# Altium project PCB_CTMB.PrjPCB
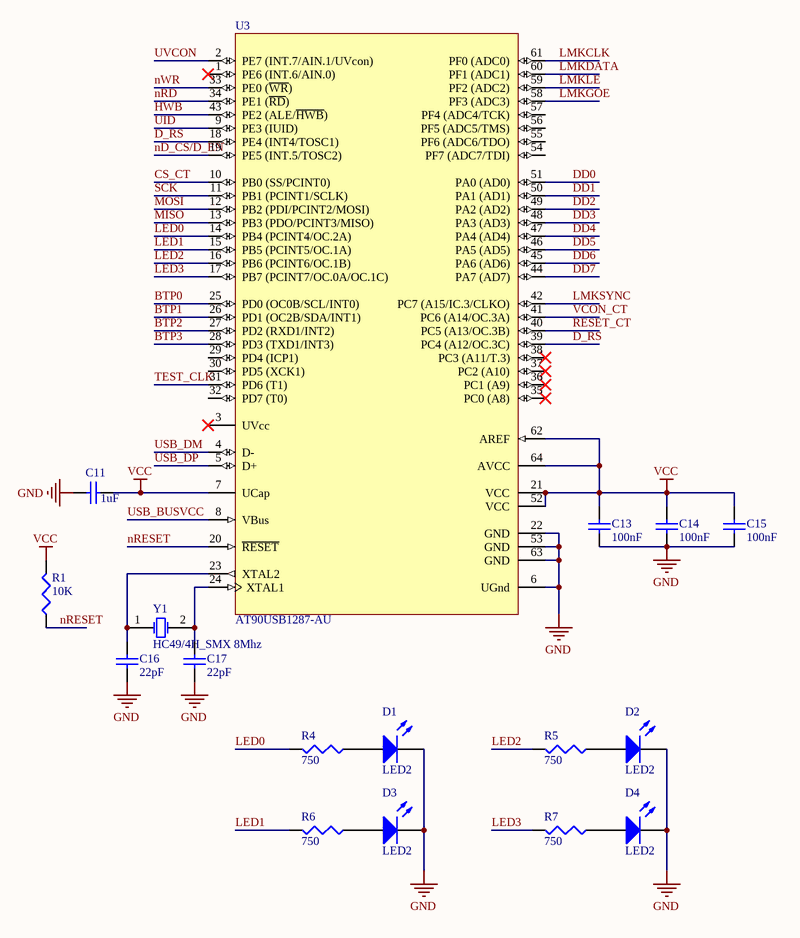
[diagram p0: ClockTamerMotherboard.SchDoc]
4 sheets, 85 parts. Net scope: global (net labels, ports and power ports of the same name join across sheets).
Board files: Board_routed.PcbDoc, Board.PcbDoc
Sheets:
  ClockTamerMotherboard.SchDoc
  Power.SchDoc
  ClockDiv.SchDoc
  Connectors.SchDoc

## Sheet ClockTamerMotherboard.SchDoc
size A4

### Parts
C11  1uF  [1608[0603]]
C13  100nF  [1608[0603]]
C14  100nF  [1608[0603]]
C15  100nF  [1608[0603]]
C16  22pF  [1608[0603]]
C17  22pF  [1608[0603]]
D1  LED2  [3.2X1.6X1.1]
D2  LED2  [3.2X1.6X1.1]
D3  LED2  [3.2X1.6X1.1]
D4  LED2  [3.2X1.6X1.1]
R1  10K  [J1-0603]
R4  750  [J1-0603]
R5  750  [J1-0603]
R6  750  [J1-0603]
R7  750  [J1-0603]
U3  AT90USB1287-AU  [64MD_N]
Y1  HC49/4H_SMX 8Mhz  [HC49/4H_SMX]

### Nets
GND: C11.1 C13.2 C14.1 C15.1 C16.1 C17.1 D1.2(K) D2.2(K) D3.2(K) D4.2(K) U3.6(UGnd) U3.22(GND) U3.53(GND) U3.63(GND)
VCC: C11.2 C13.1 C14.2 C15.2 R1.2 U3.7(UCap) U3.21(VCC) U3.52(VCC) U3.62(AREF) U3.64(AVCC)
BTP0: U3.25(PD0_(OC0B/SCL/INT0))
BTP1: U3.26(PD1_(OC2B/SDA/INT1))
BTP2: U3.27(PD2_(RXD1/INT2))
BTP3: U3.28(PD3_(TXD1/INT3))
CS_CT: U3.10(PB0_(SS/PCINT0))
D_RS: U3.18(PE4_(INT4/TOSC1)) U3.39(PC4_(A12/OC.3C))
DD0: U3.51(PA0_(AD0))
DD1: U3.50(PA1_(AD1))
DD2: U3.49(PA2_(AD2))
DD3: U3.48(PA3_(AD3))
DD4: U3.47(PA4_(AD4))
DD5: U3.46(PA5_(AD5))
DD6: U3.45(PA6_(AD6))
DD7: U3.44(PA7_(AD7))
HWB: U3.43(PE2_(ALE/~{HWB}))
LED0: R4.2 U3.14(PB4_(PCINT4/OC.2A))
LED1: R6.2 U3.15(PB5_(PCINT5/OC.1A))
LED2: R5.2 U3.16(PB6_(PCINT6/OC.1B))
LED3: R7.2 U3.17(PB7_(PCINT7/OC.0A/OC.1C))
LMKCLK: U3.61(PF0_(ADC0))
LMKDATA: U3.60(PF1_(ADC1))
LMKGOE: U3.58(PF3_(ADC3))
LMKLE: U3.59(PF2_(ADC2))
LMKSYNC: U3.42(PC7_(A15/IC.3/CLKO))
MISO: U3.13(PB3_(PDO/PCINT3/MISO))
MOSI: U3.12(PB2_(PDI/PCINT2/MOSI))
nD_CS/D_EN: U3.19(PE5_(INT.5/TOSC2))
nRD: U3.34(PE1_(~{RD}))
nRESET: R1.1 U3.20(~{RESET})
nWR: U3.33(PE0_(~{WR}))
RESET_CT: U3.40(PC5_(A13/OC.3B))
SCK: U3.11(PB1_(PCINT1/SCLK))
TEST_CLK: U3.31(PD6_(T1))
UID: U3.9(PE3_(IUID))
USB_BUSVCC: U3.8(VBus)
USB_DM: U3.4(D-)
USB_DP: U3.5(D+)
UVCON: U3.2(PE7_(INT.7/AIN.1/UVcon))
VCON_CT: U3.41(PC6_(A14/OC.3A))
NetC16_2: C16.2 U3.23(XTAL2) Y1.1(OSC1)
NetC17_2: C17.2 U3.24(XTAL1) Y1.2(OSC2)
NetD1_1: D1.1(A) R4.1
NetD2_1: D2.1(A) R5.1
NetD3_1: D3.1(A) R6.1
NetD4_1: D4.1(A) R7.1

Not connected (* = marked no-connect by the designer): U3 1(PE6_(INT.6/AIN.0))* 3(UVcc)* 29(PD4_(ICP1)) 30(PD5_(XCK1)) 32(PD7_(T0)) 35(PC0_(A8))* 36(PC1_(A9))* 37(PC2_(A10))* 38(PC3_(A11/T.3))* 54(PF7_(ADC7/TDI)) 55(PF6_(ADC6/TDO)) 56(PF5_(ADC5/TMS)) 57(PF4_(ADC4/TCK))

### Library data of the parts
C11 C13-C17 = Cap Semi: Capacitor (Semiconductor SIM Model); Published: 8-Jun-2000; LatestRevisionDate: 29-May-2009; LatestRevisionNote: IPC-7351 Footprint Added.; PackageReference: C1206; Publisher: Altium Limited; PackageDescription: Chip Capacitor
  C11: Value: 1uF
  C13-C15: Value: 100nF
  C16 C17: Value: 22pF
D1-D4 = LED2: Typical RED, GREEN, YELLOW, AMBER GaAs LED; Published: 8-Jun-2000; LatestRevisionDate: 17-Jul-2002; LatestRevisionNote: Re-released for DXP Platform.; PackageVersion: Feb-2002; PackageReference: 3.2X1.6X1.1; Publisher: Altium Limited; PackageDescription: SM LED; 2 Flat Leads
R1 R4-R7 = Res3: Resistor; Published: 8-Jun-2000; LatestRevisionDate: 29-May-2009; LatestRevisionNote: IPC-7351 Footprint Added.; PackageReference: J1-0603; Publisher: Altium Limited; PackageDescription: Chip Resistor
  R1: Value: 10K
  R4-R7: Value: 750
U3 = AT90USB1287-AU: 8-bit AVR Microcontroller, 2.7-5.5V, 128KB Flash, 4KB EEPROM, 8KB SRAM, USB OTG Host, 64-pin TQFP, Industrial Grade (-40°C to 85°C); Published: 1-Apr-2010; DatasheetVersion: revK, Nov-2009; PackageVersion: revF, Jul-2007; PackageReference: 64MD; Publisher: Altium Limited; PackageDescription: 64-Pin Plastic Thin Profile Quad Flat Pack, 14 x 14 x 1.0 mm Body, 0.8 mm Pitch (TQFP); Supplier 1: Digi-Key; Supplier Part Number 1: AT90USB1287-AU-ND; Supplier 2: Farnell; Supplier Part Number 2: 1748496; Supplier 3: Mouser; Supplier Part Number 3: 556-AT90USB1287-AU; Code_JEDEC: MS-026-AEB; ComponentLink1Description: Manufacturer Link; ComponentLink1URL: http://www.atmel.com/products/avr/default.asp?; ComponentLink2Description: AT90USB1286/1287/646/647 Datasheet; ComponentLink2URL: http://www.atmel.com/dyn/resources/prod_documents/doc7593.pdf; ComponentLink3Description: AT90USB1286/1287/646/647 Summary; ComponentLink3URL: http://www.atmel.com/dyn/resources/prod_documents/7593S.pdf; ComponentLink4Description: Atmel.com Home; ComponentLink4URL: http://www.atmel.com
Y1 = HC49/4H_SMX: Surface Mount Quartz Crystal; Note: PCB layout complies with manufacturer's recommendation.; Published: 17-Jul-2002; DatasheetDocument: 18-Oct-1999; PackageDocument: 18-Oct-1999; PackageReference: HC49/4H_SMX; Publisher: Altium Limited; ComponentLink1Description: Manufacturer Link; ComponentLink1URL: http://www.cmac.com/mt/; ComponentLink2Description: Datasheet; ComponentLink2URL: http://www.cmac.com/mt/databook/crystals/smd/hc49_4h_smx.pdf

## Sheet Power.SchDoc
size A4
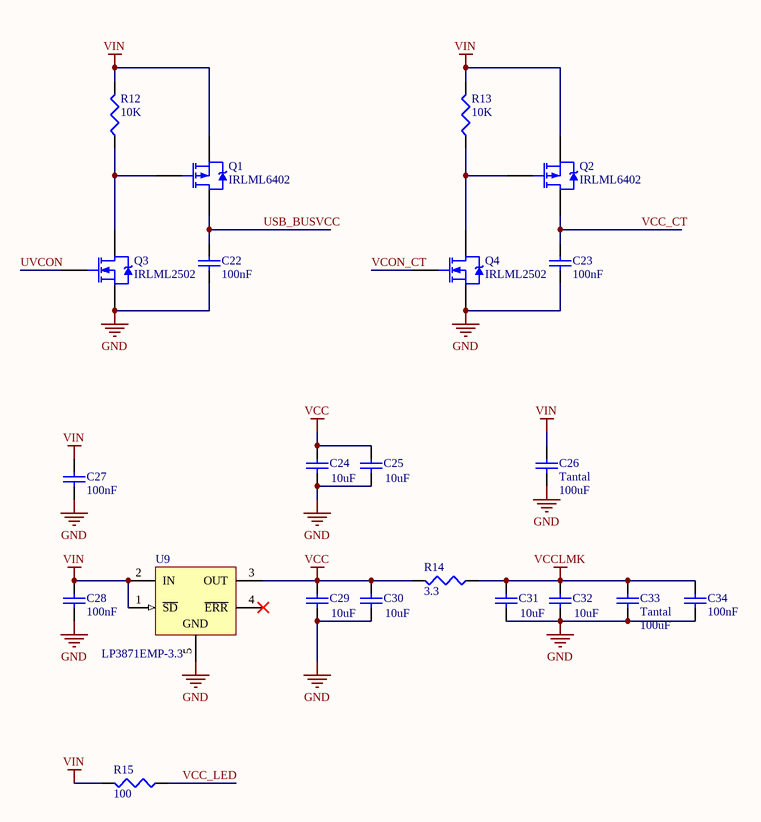
[diagram p1: Power.SchDoc]

### Parts
C22  100nF  [1608[0603]]
C23  100nF  [1608[0603]]
C24  10uF  [C1210]
C25  10uF  [C1210]
C26  Tantal  value 100uF  [C2512]
C27  100nF  [1608[0603]]
C28  100nF  [1608[0603]]
C29  10uF  [C1210]
C30  10uF  [C1210]
C31  10uF  [C1210]
C32  10uF  [C1210]
C33  Tantal  value 100uF  [C2512]
C34  100nF  [1608[0603]]
Q1  IRLML6402  [SOT-23_N]
Q2  IRLML6402  [SOT-23_N]
Q3  IRLML2502  [SOT-23_N]
Q4  IRLML2502  [SOT-23_N]
R12  10K  [J1-0603]
R13  10K  [J1-0603]
R14  3.3  [J1-0603]
R15  100  [J1-0603]
U9  LP3871EMP-3.3  [MP05A_N]

### Nets
GND: C22.2 C23.2 C24.1 C25.1 C26.1 C27.2 C28.2 C29.1 C30.1 C31.1 C32.1 C33.1 C34.2 Q3.2(S) Q4.2(S) U9.5(GND)
VCC: C24.2 C25.2 C29.2 C30.2 R14.2 U9.3(OUT)
VCCLMK: C31.2 C32.2 C33.2 C34.1 R14.1
VIN: C26.2 C27.1 C28.1 Q1.2(S) Q2.2(S) R12.2 R13.2 R15.2 U9.1(~{SD}) U9.2(IN)
USB_BUSVCC: C22.1 Q1.3(D)
UVCON: Q3.1(G)
VCC_CT: C23.1 Q2.3(D)
VCC_LED: R15.1
VCON_CT: Q4.1(G)
NetQ1_1: Q1.1(G) Q3.3(D) R12.1
NetQ2_1: Q2.1(G) Q4.3(D) R13.1

Not connected (* = marked no-connect by the designer): U9 4(~{ERR})*

### Library data of the parts
C22-C34 = Cap Semi: Capacitor (Semiconductor SIM Model); Published: 8-Jun-2000; LatestRevisionDate: 29-May-2009; LatestRevisionNote: IPC-7351 Footprint Added.; PackageReference: C1206; Publisher: Altium Limited; PackageDescription: Chip Capacitor
  C22 C23 C27 C28 C34: Value: 100nF
  C24 C25 C29-C32: Value: 10uF
Q1 Q2 = IRLML6302: HEXFET Power MOSFET; Published: 8-Jun-2000; LatestRevisionDate: 20-Nov-2009; LatestRevisionNote: IPC-7351 Footprint Added.; DatasheetVersion: Aug-1997; PackageReference: SOT-23; Publisher: Altium Limited; PackageDescription: 3-Pin SOT-23 Package 0.95 mm Pitch, 2.3 mm Lead Span; ComponentLink1Description: Manufacturer Link; ComponentLink1URL: http://www.irf.com/; ComponentLink2Description: Datasheet; ComponentLink2URL: http://www.irf.com/product-info/datasheets/data/irlml6302.pdf
Q3 Q4 = IRLML2402: HEXFET Power MOSFET; Published: 8-Jun-2000; LatestRevisionDate: 20-Nov-2009; LatestRevisionNote: IPC-7351 Footprint Added.; DatasheetVersion: Aug-1997; PackageReference: SOT-23; Publisher: Altium Limited; PackageDescription: 3-Pin SOT-23 Package 0.95 mm Pitch, 2.3 mm Lead Span; ComponentLink1Description: Manufacturer Link; ComponentLink1URL: http://www.irf.com/; ComponentLink2Description: Datasheet; ComponentLink2URL: http://www.irf.com/product-info/datasheets/data/irlml2402.pdf
R12-R15 = Res3: Resistor; Published: 8-Jun-2000; LatestRevisionDate: 29-May-2009; LatestRevisionNote: IPC-7351 Footprint Added.; PackageReference: J1-0603; Publisher: Altium Limited; PackageDescription: Chip Resistor
  R12 R13: Value: 10K
  R14: Value: 3.3
  R15: Value: 100
U9 = LP3871EMP-3.3: 0.8A Fast Ultra Low Dropout Linear Regulators, 5-pin SOT-223; Manufacturer: National Semiconductor; PackageTopMarking: XYTT*LH8B; PowerWise: N; CompType: LDO IC; Published: 4-Dec-2008; DatasheetVersion: Sep-2006; PackageVersion: revA, Jan-2000; PackageReference: MP05A; Publisher: Altium Limited; PackageDescription: Moldec SOT-223, 6.50 x 3.56 x 1.6mm Body, 5 Lead, 1.5mm Pitch; Supplier 1: Farnell; Supplier Part Number 1: 8188246; PartNumber: LP3871EMP-3.3; RoHS: N; PinCount: 5; Code_JEDEC: TO-261-AB; Code_IPC: SOT223-5; ComponentLink1Description: LP3871 Datasheet; ComponentLink1URL: http://www.national.com/ds/LP/LP3871.pdf; ComponentLink2Description: LP3871 Web Page; ComponentLink2URL: http://www.national.com/pf/LP/LP3871.html; ComponentLink3Description: MP05A Package Page; ComponentLink3URL: http://www.national.com/packaging/folders/mp05a.html

## Sheet ClockDiv.SchDoc
size A4
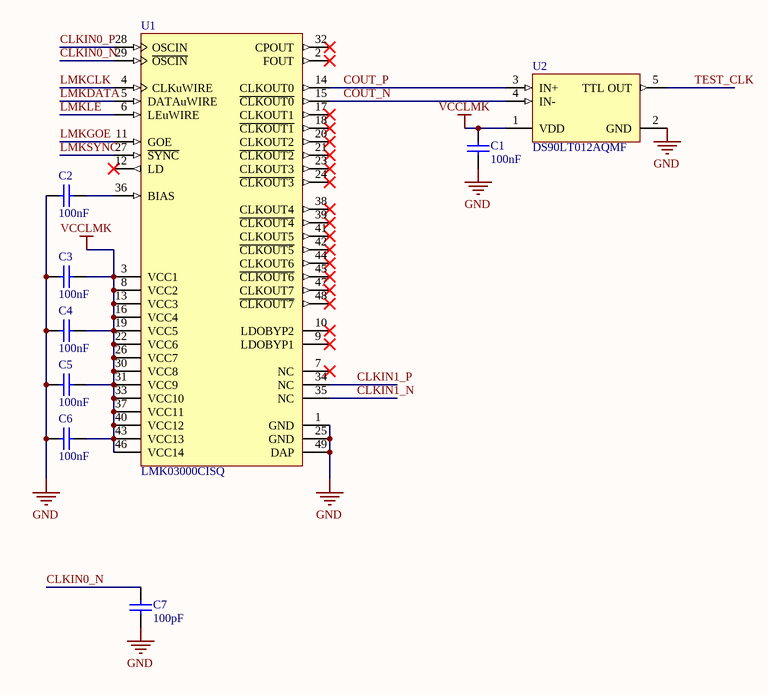
[diagram p2: ClockDiv.SchDoc]

### Parts
C1  100nF  [1608[0603]]
C2  100nF  [1608[0603]]
C3  100nF  [1608[0603]]
C4  100nF  [1608[0603]]
C5  100nF  [1608[0603]]
C6  100nF  [1608[0603]]
C7  100pF  [1608[0603]]
U1  LMK03000CISQ  [SQ48A-04]
U2  DS90LT012AQMF  [MF05A_N]

### Nets
GND: C1.1 C2.1 C3.1 C4.1 C5.1 C6.1 C7.1 U1.1(GND) U1.25(GND) U1.49(DAP) U2.2(GND)
VCCLMK: C1.2 C3.2 C4.2 C5.2 C6.2 U1.3(VCC1) U1.8(VCC2) U1.13(VCC3) U1.16(VCC4) U1.19(VCC5) U1.22(VCC6) U1.26(VCC7) U1.30(VCC8) U1.31(VCC9) U1.33(VCC10) U1.37(VCC11) U1.40(VCC12) U1.43(VCC13) U1.46(VCC14) U2.1(VDD)
CLKIN0_N: C7.2 U1.29(~{OSCIN})
CLKIN0_P: U1.28(OSCIN)
CLKIN1_N: U1.35(NC)
CLKIN1_P: U1.34(NC)
COUT_N: U1.15(~{CLKOUT0}) U2.4(IN-)
COUT_P: U1.14(CLKOUT0) U2.3(IN+)
LMKCLK: U1.4(CLKuWIRE)
LMKDATA: U1.5(DATAuWIRE)
LMKGOE: U1.11(GOE)
LMKLE: U1.6(LEuWIRE)
LMKSYNC: U1.27(~{SYNC})
TEST_CLK: U2.5(TTL_OUT)
NetC2_2: C2.2 U1.36(BIAS)

Not connected (* = marked no-connect by the designer): U1 2(FOUT)* 7(NC)* 9(LDOBYP1)* 10(LDOBYP2)* 12(LD)* 17(CLKOUT1)* 18(~{CLKOUT1})* 20(CLKOUT2)* 21(~{CLKOUT2})* 23(CLKOUT3)* 24(~{CLKOUT3})* 32(CPOUT)* 38(CLKOUT4)* 39(~{CLKOUT4})* 41(CLKOUT5)* 42(~{CLKOUT5})* 44(CLKOUT6)* 45(~{CLKOUT6})* 47(CLKOUT7)* 48(~{CLKOUT7})*

### Library data of the parts
C1-C7 = Cap Semi: Capacitor (Semiconductor SIM Model); Published: 8-Jun-2000; LatestRevisionDate: 29-May-2009; LatestRevisionNote: IPC-7351 Footprint Added.; PackageReference: C1206; Publisher: Altium Limited; PackageDescription: Chip Capacitor
  C1-C6: Value: 100nF
  C7: Value: 100pF
U1 = LMK03001CISQ: Precision Clock Conditioner with Integrated VCO
U2 = DS90LT012AQMF: Automotive LVDS Differential Line Receiver, 5-pin SOT-23; Manufacturer: National Semiconductor; PackageTopMarking: N03Q*XTT; PowerWise: N; CompType: Interface IC; Published: 4-Dec-2008; DatasheetVersion: Oct-2008; PackageVersion: revD, Aug-2008; PackageReference: MF05A; Publisher: Altium Limited; PackageDescription: Molded SOT-23, .115 x .063 x .040 in Body, 5 Lead, .0375 in Pitch; PartNumber: DS90LT012AQMF; RoHS: Y; PinCount: 5; ComponentLink1Description: DS90LT012AQ Datasheet; ComponentLink1URL: http://www.national.com/ds/DS/DS90LT012AQ.pdf; ComponentLink2Description: DS90LT012AQ Web Page; ComponentLink2URL: http://www.national.com/pf/DS/DS90LT012AQ.html; ComponentLink3Description: MF05A Package Page; ComponentLink3URL: http://www.national.com/packaging/folders/mf05a.html

## Sheet Connectors.SchDoc
size A4
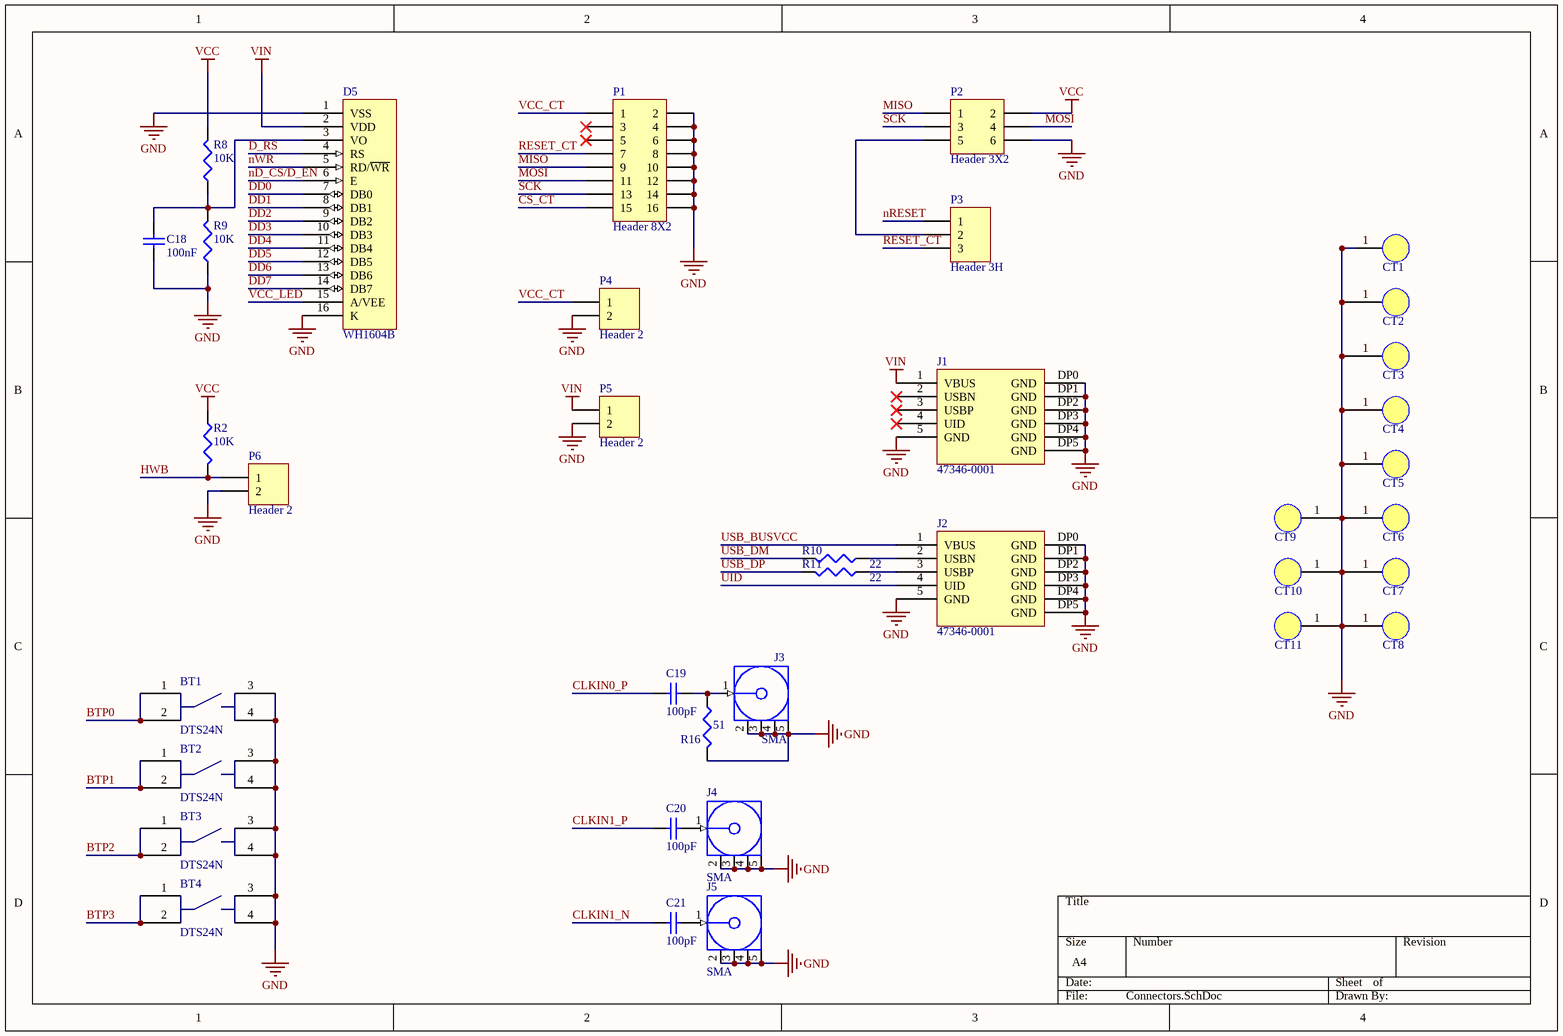
[diagram p3: Connectors.SchDoc]

### Parts
BT1  DTS24N  [DTS24N]
BT2  DTS24N  [DTS24N]
BT3  DTS24N  [DTS24N]
BT4  DTS24N  [DTS24N]
C18  100nF  [1608[0603]]
C19  100pF  [1608[0603]]
C20  100pF  [1608[0603]]
C21  100pF  [1608[0603]]
CT1  MTHOLE_3mm  [MTHOLE]  (value not drawn)
CT2  MTHOLE_3mm  [MTHOLE]  (value not drawn)
CT3  MTHOLE_3mm  [MTHOLE]  (value not drawn)
CT4  MTHOLE_3mm  [MTHOLE]  (value not drawn)
CT5  MTHOLE_3mm  [MTHOLE]  (value not drawn)
CT6  MTHOLE_3mm  [MTHOLE]  (value not drawn)
CT7  MTHOLE_3mm  [MTHOLE]  (value not drawn)
CT8  MTHOLE_3mm  [MTHOLE]  (value not drawn)
CT9  MTHOLE_3mm  [MTHOLE]  (value not drawn)
CT10  MTHOLE_3mm  [MTHOLE]  (value not drawn)
CT11  MTHOLE_3mm  [MTHOLE]  (value not drawn)
D5  WH1604B  [WH1604A]
J1  47346-0001  [USB_MICRO]
J2  47346-0001  [USB_MICRO]
J3  SMA  [SMA]
J4  SMA  [SMA]
J5  SMA  [SMA]
P1  Header 8X2  [HDR2X8]
P2  Header 3X2  [HDR2X3]
P3  Header 3H  [HDR1X3H]
P4  Header 2  [HDR1X2]
P5  Header 2  [HDR1X2]
P6  Header 2  [HDR1X2]
R2  10K  [J1-0603]
R8  10K  [J1-0603]
R9  10K  [J1-0603]
R10  22  [J1-0603]
R11  22  [J1-0603]
R16  51  [J1-0603]

### Nets
GND: BT1.3 BT1.4 BT2.3 BT2.4 BT3.3 BT3.4 BT4.3 BT4.4 C18.2 CT1.1 CT2.1 CT3.1 CT4.1 CT5.1 CT6.1 CT7.1 CT8.1 CT9.1 CT10.1 CT11.1 D5.1(VSS) D5.16(K) J1.5(GND) J1.DP0(GND) J1.DP1(GND) J1.DP2(GND) J1.DP3(GND) J1.DP4(GND) J1.DP5(GND) J2.5(GND) J2.DP0(GND) J2.DP1(GND) J2.DP2(GND) J2.DP3(GND) J2.DP4(GND) J2.DP5(GND) J3.2(GND) J3.3(GND) J3.4(GND) J3.5(GND) J4.2(GND) J4.3(GND) J4.4(GND) J4.5(GND) J5.2(GND) J5.3(GND) J5.4(GND) J5.5(GND) P1.2 P1.4 P1.6 P1.8 P1.10 P1.12 P1.14 P1.16 P2.6 P4.2 P5.2 P6.2 R9.1 R16.2
VCC: P2.2 R2.1 R8.2
VIN: D5.2(VDD) J1.1(VBUS) P5.1
BTP0: BT1.1 BT1.2
BTP1: BT2.1 BT2.2
BTP2: BT3.1 BT3.2
BTP3: BT4.1 BT4.2
CLKIN0_P: C19.2
CLKIN1_N: C21.2
CLKIN1_P: C20.2
CS_CT: P1.15
D_RS: D5.4(RS)
DD0: D5.7(DB0)
DD1: D5.8(DB1)
DD2: D5.9(DB2)
DD3: D5.10(DB3)
DD4: D5.11(DB4)
DD5: D5.12(DB5)
DD6: D5.13(DB6)
DD7: D5.14(DB7)
HWB: P6.1 R2.2
MISO: P1.9 P2.1
MOSI: P1.11 P2.4
nD_CS/D_EN: D5.6(E)
nRESET: P3.1
nWR: D5.5(RD/~{WR})
RESET_CT: P1.7 P3.3
SCK: P1.13 P2.3
UID: J2.4(UID)
USB_BUSVCC: J2.1(VBUS)
USB_DM: R10.2
USB_DP: R11.2
VCC_CT: P1.1 P4.1
VCC_LED: D5.15(A/VEE)
NetC18_1: C18.1 D5.3(VO) R8.1 R9.2
NetC19_1: C19.1 J3.1(Signal) R16.1
NetC20_1: C20.1 J4.1(Signal)
NetC21_1: C21.1 J5.1(Signal)
NetJ2_2: J2.2(USBN) R10.1
NetJ2_3: J2.3(USBP) R11.1
NetP2_5: P2.5 P3.2

Not connected (* = marked no-connect by the designer): J1 2(USBN)* 3(USBP)* 4(UID)*; P1 3* 5*

### Library data of the parts
C18-C21 = Cap Semi: Capacitor (Semiconductor SIM Model); Published: 8-Jun-2000; LatestRevisionDate: 29-May-2009; LatestRevisionNote: IPC-7351 Footprint Added.; PackageReference: C1206; Publisher: Altium Limited; PackageDescription: Chip Capacitor
  C18: Value: 100nF
  C19-C21: Value: 100pF
J1 J2 = 47346-0001: Micro USB Molex
P1 = Header 8X2: Header, 8-Pin, Dual row; LatestRevisionDate: 17-Jul-2002; LatestRevisionNote: Re-released for DXP Platform.; Publisher: Altium Limited
P2 = Header 3X2: Header, 3-Pin, Dual row; LatestRevisionDate: 17-Jul-2002; LatestRevisionNote: Re-released for DXP Platform.; Publisher: Altium Limited
P3 = Header 3H: Header, 3-Pin, Right Angle; LatestRevisionDate: 17-Jul-2002; LatestRevisionNote: Re-released for DXP Platform.; Publisher: Altium Limited
P4-P6 = Header 2: Header, 2-Pin; LatestRevisionDate: 17-Jul-2002; LatestRevisionNote: Re-released for DXP Platform.; Publisher: Altium Limited
R2 R8-R11 R16 = Res3: Resistor; Published: 8-Jun-2000; LatestRevisionDate: 29-May-2009; LatestRevisionNote: IPC-7351 Footprint Added.; PackageReference: J1-0603; Publisher: Altium Limited; PackageDescription: Chip Resistor
  R2 R8 R9: Value: 10K
  R10 R11: Value: 22
  R16: Value: 51
D5 = WH1604B: Value: WH1604B

## Nets that join several sheets
GND: ClockTamerMotherboard (14 pins), Power (16 pins), ClockDiv (11 pins), Connectors (62 pins)
VCC: ClockTamerMotherboard (10 pins), Power (6 pins), Connectors (P2.2 R2.1 R8.2)
VCCLMK: Power (5 pins), ClockDiv (20 pins)
VIN: Power (10 pins), Connectors (D5.2 J1.1 P5.1)
BTP0: ClockTamerMotherboard (U3.25), Connectors (BT1.1 BT1.2)
BTP1: ClockTamerMotherboard (U3.26), Connectors (BT2.1 BT2.2)
BTP2: ClockTamerMotherboard (U3.27), Connectors (BT3.1 BT3.2)
BTP3: ClockTamerMotherboard (U3.28), Connectors (BT4.1 BT4.2)
CLKIN0_P: ClockDiv (U1.28), Connectors (C19.2)
CLKIN1_N: ClockDiv (U1.35), Connectors (C21.2)
CLKIN1_P: ClockDiv (U1.34), Connectors (C20.2)
CS_CT: ClockTamerMotherboard (U3.10), Connectors (P1.15)
D_RS: ClockTamerMotherboard (U3.18 U3.39), Connectors (D5.4)
DD0: ClockTamerMotherboard (U3.51), Connectors (D5.7)
DD1: ClockTamerMotherboard (U3.50), Connectors (D5.8)
DD2: ClockTamerMotherboard (U3.49), Connectors (D5.9)
DD3: ClockTamerMotherboard (U3.48), Connectors (D5.10)
DD4: ClockTamerMotherboard (U3.47), Connectors (D5.11)
DD5: ClockTamerMotherboard (U3.46), Connectors (D5.12)
DD6: ClockTamerMotherboard (U3.45), Connectors (D5.13)
DD7: ClockTamerMotherboard (U3.44), Connectors (D5.14)
HWB: ClockTamerMotherboard (U3.43), Connectors (P6.1 R2.2)
LMKCLK: ClockTamerMotherboard (U3.61), ClockDiv (U1.4)
LMKDATA: ClockTamerMotherboard (U3.60), ClockDiv (U1.5)
LMKGOE: ClockTamerMotherboard (U3.58), ClockDiv (U1.11)
LMKLE: ClockTamerMotherboard (U3.59), ClockDiv (U1.6)
LMKSYNC: ClockTamerMotherboard (U3.42), ClockDiv (U1.27)
MISO: ClockTamerMotherboard (U3.13), Connectors (P1.9 P2.1)
MOSI: ClockTamerMotherboard (U3.12), Connectors (P1.11 P2.4)
nD_CS/D_EN: ClockTamerMotherboard (U3.19), Connectors (D5.6)
nRESET: ClockTamerMotherboard (R1.1 U3.20), Connectors (P3.1)
nWR: ClockTamerMotherboard (U3.33), Connectors (D5.5)
RESET_CT: ClockTamerMotherboard (U3.40), Connectors (P1.7 P3.3)
SCK: ClockTamerMotherboard (U3.11), Connectors (P1.13 P2.3)
TEST_CLK: ClockTamerMotherboard (U3.31), ClockDiv (U2.5)
UID: ClockTamerMotherboard (U3.9), Connectors (J2.4)
USB_BUSVCC: ClockTamerMotherboard (U3.8), Power (C22.1 Q1.3), Connectors (J2.1)
USB_DM: ClockTamerMotherboard (U3.4), Connectors (R10.2)
USB_DP: ClockTamerMotherboard (U3.5), Connectors (R11.2)
UVCON: ClockTamerMotherboard (U3.2), Power (Q3.1)
VCC_CT: Power (C23.1 Q2.3), Connectors (P1.1 P4.1)
VCC_LED: Power (R15.1), Connectors (D5.15)
VCON_CT: ClockTamerMotherboard (U3.41), Power (Q4.1)